# EasyEDA Pro project ProPrj_vTally32-Multi_2024-12-10.epro

# Schematic VISCA32CONV
Board Name: Board1; Create Date: 2024-11-26; Page Name: P1; Project Name: vTally32-Multi; Schematic Name: Schematic1; Update Date: 2024-12-03; Company: EasyEDA.com; Drawn: EasyEDA; Page Size: A4; Part Number: JLCPCB-002; Reviewed: EasyEDA; Version: V0.1
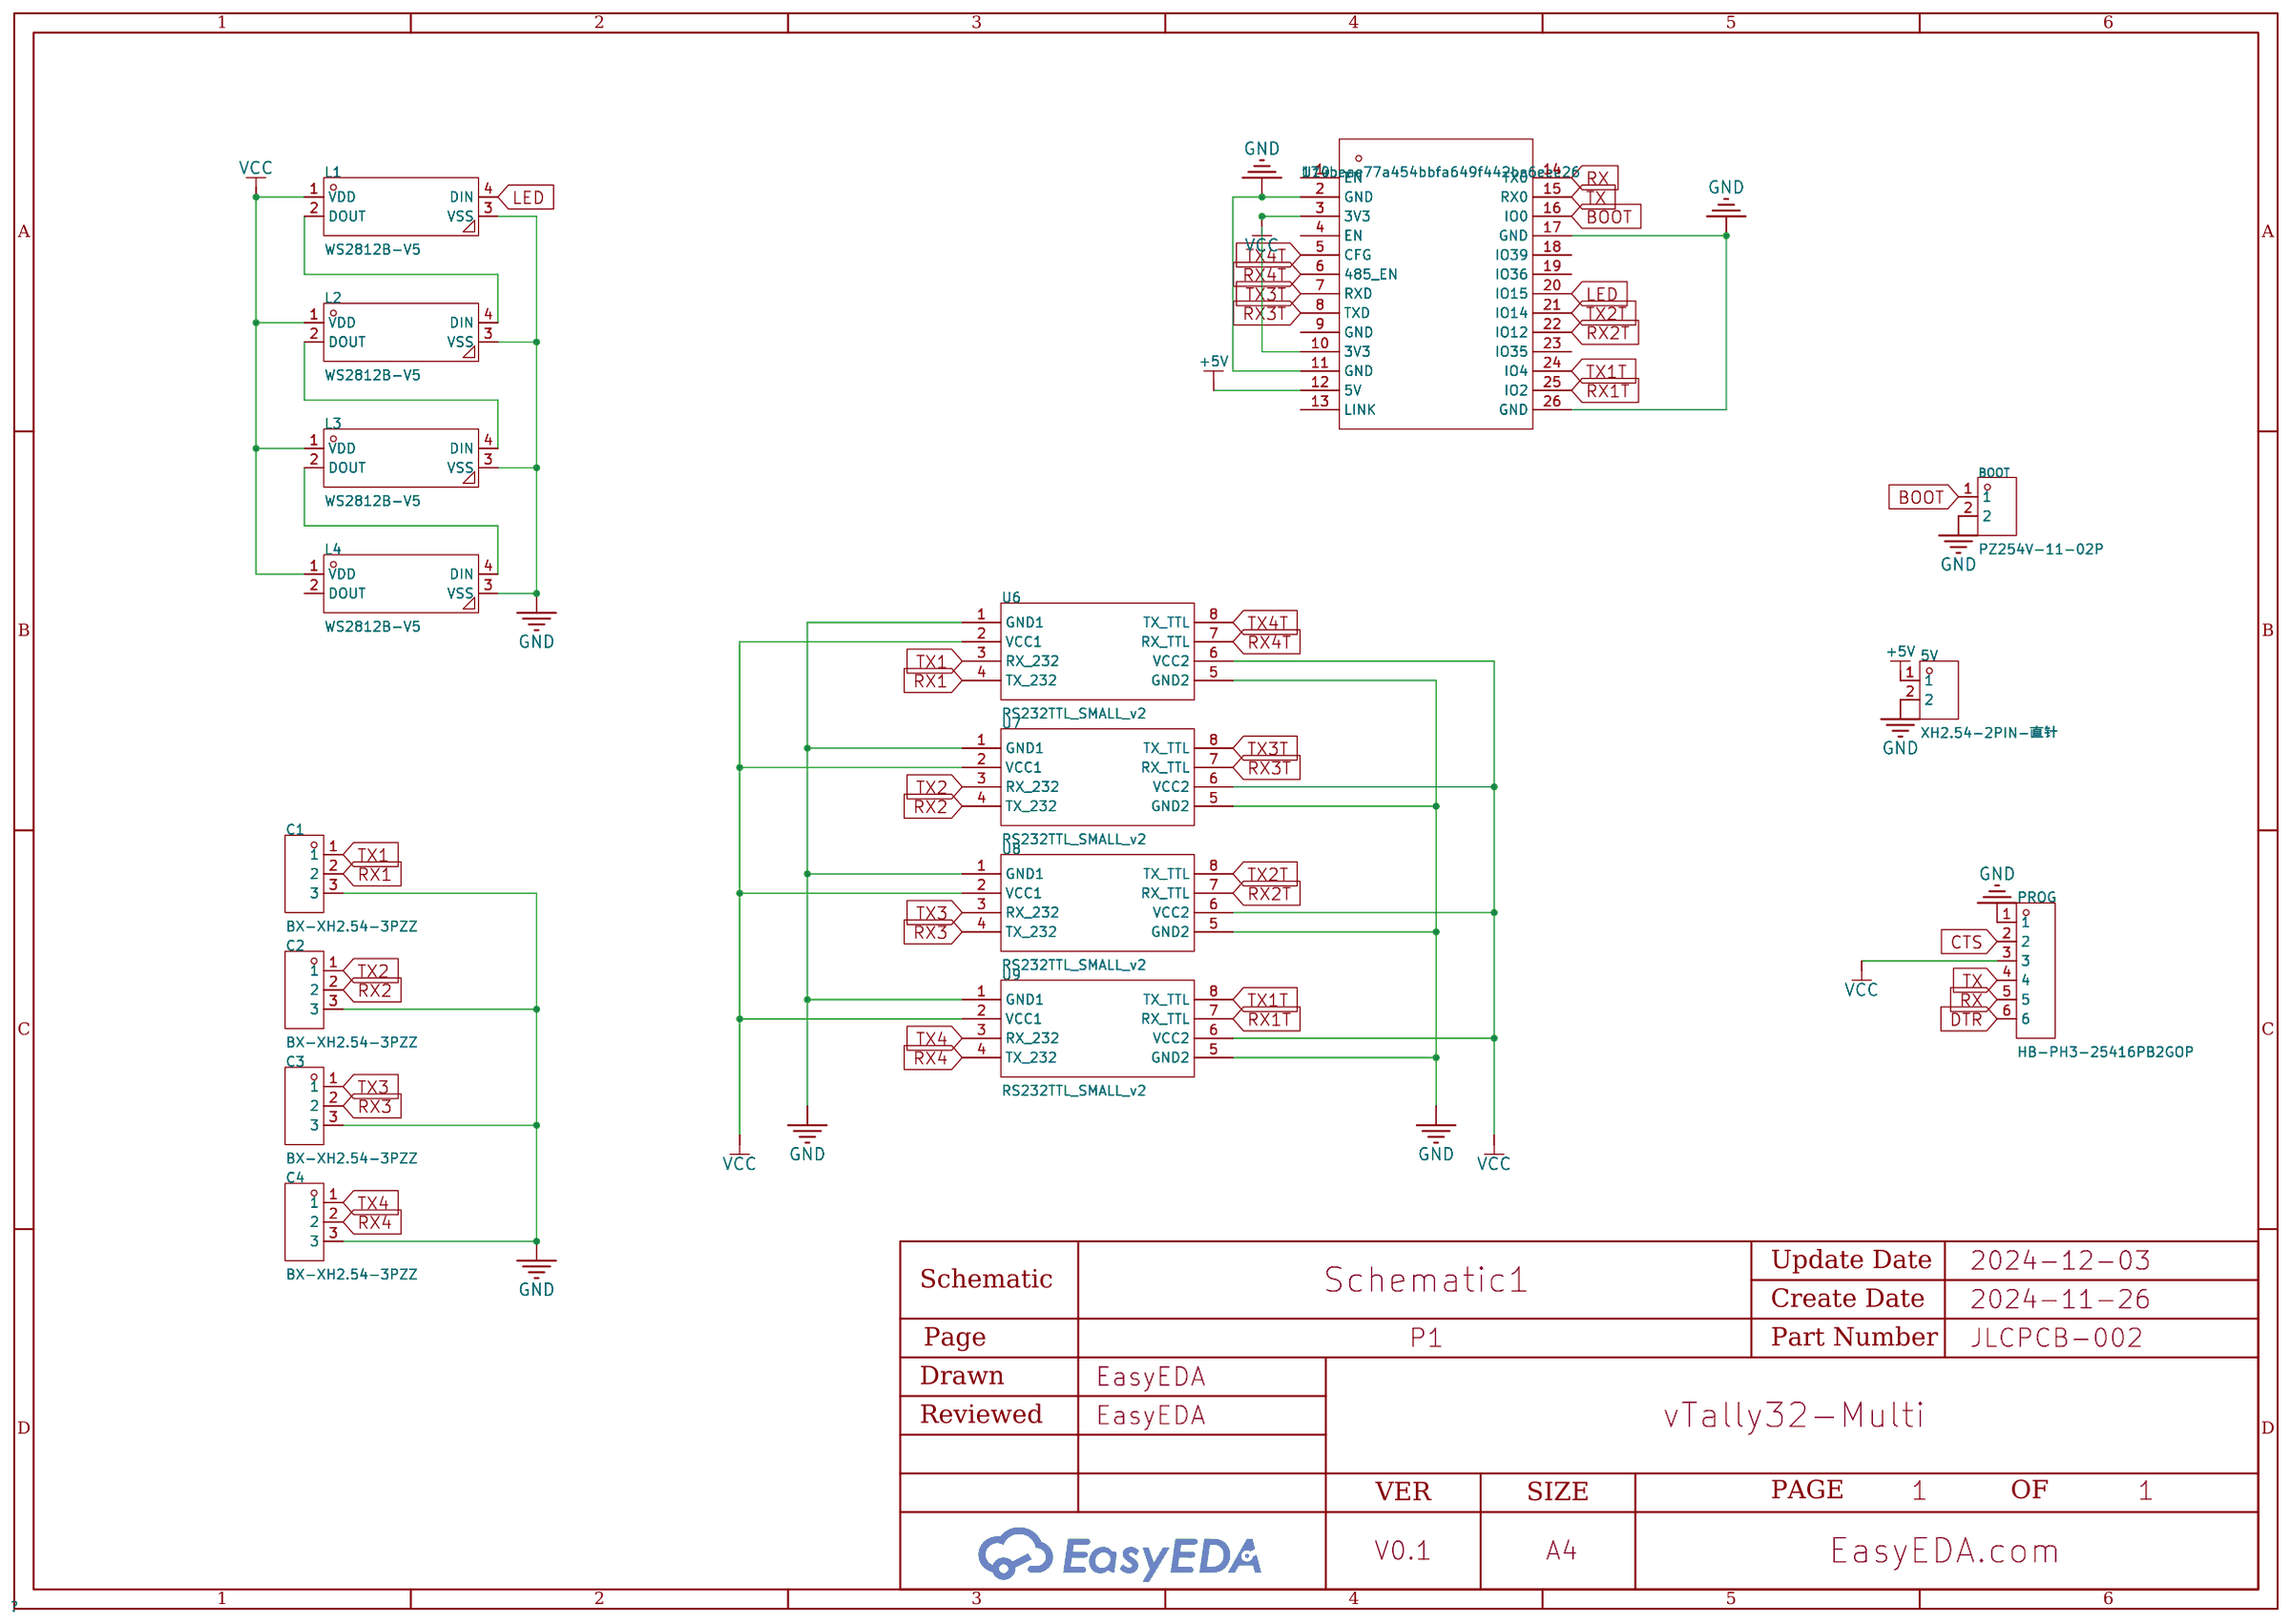
[diagram p0: schematic sheet]

## Parts
5V  XH2.54-2PIN-直针  [CONN-TH_XH2.54-2P]
BOOT  PZ254V-11-02P  [HDR-TH_2P-P2.54-V-M]
C1  BX-XH2.54-3PZZ  [CONN-TH_3P-P2.50_BX-XH2.54-3PZZ]
C2  BX-XH2.54-3PZZ  [CONN-TH_3P-P2.50_BX-XH2.54-3PZZ]
C3  BX-XH2.54-3PZZ  [CONN-TH_3P-P2.50_BX-XH2.54-3PZZ]
C4  BX-XH2.54-3PZZ  [CONN-TH_3P-P2.50_BX-XH2.54-3PZZ]
L1  WS2812B-V5  [LED-SMD_4P-L5.0-W5.0-LS5.4-TL-1]
L2  WS2812B-V5  [LED-SMD_4P-L5.0-W5.0-LS5.4-TL-1]
L3  WS2812B-V5  [LED-SMD_4P-L5.0-W5.0-LS5.4-TL-1]
L4  WS2812B-V5  [LED-SMD_4P-L5.0-W5.0-LS5.4-TL-1]
PROG  HB-PH3-25416PB2GOP  [HDR-TH_6P-P2.54-V-M]
U6  RS232TTL_SMALL_v2  [RS232TTL_SMALL]
U7  RS232TTL_SMALL_v2  [RS232TTL_SMALL]
U8  RS232TTL_SMALL_v2  [RS232TTL_SMALL]
U9  RS232TTL_SMALL_v2  [RS232TTL_SMALL]
U10  174beae77a454bbfa649f442be6eee26  [WT32-ETH01]

## Library data of the parts
5V = XH2.54-2PIN-直针: Supplier Part: C9900011425; Supplier Footprint: XH2.54-2PIN; JLCPCB Part Class: Extended Part; Supplier: LCSC
BOOT = PZ254V-11-02P: Pin Structure:1x2P Pitch:2.54mm Row Spacing:- Circluar Pins/Square Pins:Square Pins Mounting Type:Straight Number of Rows:Plugin Number of Pins:2P Current Rating (Max):- Voltage Rating (Max):- Length of Mating Pin:6mm Insulation Height:2.5mm Length of End; LCSC Part Name: 间距:2.54mm 1x2P 直插 方针; Supplier Part: C492401; Manufacturer: XFCN(兴飞); Supplier Footprint: 插件,P=2.54mm; JLCPCB Part Class: Extended Part; Datasheet: https://atta.szlcsc.com/upload/public/pdf/source/20200309/C492401_A812433581A9B211A7FFA413ADDFF0E5.pdf; Supplier: LCSC; Pin Structure: 1x2P; Pitch: 2.54mm; Circluar Pins/Square Pins: Square Pins; Mounting Type: Straight; Number of Rows: Plugin; Number of Pins: 2P; Length of Mating Pin: 6mm; Insulation Height: 2.5mm; Length of End Connection Pin: 3mm; Operating Temperature Range: -40℃~+105℃; Color: Black
C1-C4 = BX-XH2.54-3PZZ: Pins Structure:1x3P Pitch:2.54mm Mounting Style:Direct Insert Reference Series:XH Number of Pins:3P Number of Rows:1 Number of PINs Per Row:3 Row Spacing:- Current Rating (Max):3A Contact Material:Brass Contact Plating:Tin Operating Temperature Range:-25℃; Supplier Part: C18077834; Manufacturer: Bossie(博锡); Supplier Footprint: 插件,P=2.54mm; JLCPCB Part Class: Extended Part; Datasheet: https://atta.szlcsc.com/upload/public/pdf/source/20231017/BF89167887E1F965B2791D14EC788A09.pdf; Supplier: LCSC; Pins Structure: 1x3P; Pitch: 2.54mm; Mounting Style: Direct Insert; Reference Series: XH; Number of Pins: 3P; Number of Rows: 1; Number of PINs Per Row: 3; Current Rating (Max): 3A; Contact Material: Brass; Contact Plating: Tin; Operating Temperature Range: -25℃~+85℃
L1-L4 = WS2812B-V5_C2846931: Supplier Part: C2846931; Manufacturer: worldsemi; Supplier Footprint: SMD5050; JLCPCB Part Class: Extended Part; Datasheet: https://atta.szlcsc.com/upload/public/pdf/source/20211224/E1D51490BF3990BC3747CA833459C67A.pdf; Supplier: LCSC
PROG = HB-PH3-25416PB2GOP: Pin Structure:1x6P Pitch:2.54mm Row Spacing:2.54mm Circluar Pins/Square Pins:Square Pins Mounting Type:Straight Number of Rows:Plugin Number of Pins:6P Current Rating (Max):3A Voltage Rating (Max):250V Length of Mating Pin:6mm Insulation Height:2.54mm Len; LCSC Part Name: 间距:2.54mm 1x6P 直插 方针; Supplier Part: C6332199; Manufacturer: HANBO(汉博); Supplier Footprint: 插件,P=2.54mm; JLCPCB Part Class: Extended Part; Datasheet: https://atta.szlcsc.com/upload/public/pdf/source/20230803/F72D259687963761DF1B552F3BB84A31.pdf; Supplier: LCSC; Pin Structure: 1x6P; Pitch: 2.54mm; Row Spacing: 2.54mm; Circluar Pins/Square Pins: Square Pins; Mounting Type: Straight; Number of Rows: Plugin; Number of Pins: 6P; Current Rating (Max): 3A; Voltage Rating (Max): 250V; Length of Mating Pin: 6mm; Insulation Height: 2.54mm; Length of End Connection Pin: 3mm; Contact Plating: Gold; Operating Temperature Range: -40℃~+105℃; Soldering Temperature(Max): 260℃; Color: Black
U6-U9 = RS232TTL_SMALL_v2: Supplier: BANGGOOD
U10 = WT32-ETH01: Wireless-tag WT32-ETH01

## Nets
+5V: 5V.1 U10.12(5V)
GND: 5V.2 BOOT.2 C1.3 C2.3 C3.3 C4.3 L1.3(VSS) L2.3(VSS) L3.3(VSS) L4.3(VSS) PROG.1 U6.1(GND1) U6.5(GND2) U7.1(GND1) U7.5(GND2) U8.1(GND1) U8.5(GND2) U9.1(GND1) U9.5(GND2) U10.2(GND) U10.11(GND) U10.17(GND) U10.26(GND)
VCC: L1.1(VDD) L2.1(VDD) L3.1(VDD) L4.1(VDD) PROG.3 U6.2(VCC1) U6.6(VCC2) U7.2(VCC1) U7.6(VCC2) U8.2(VCC1) U8.6(VCC2) U9.2(VCC1) U9.6(VCC2) U10.3(3V3) U10.10(3V3)
BOOT: BOOT.1 U10.16(IO0)
CTS: PROG.2
DTR: PROG.6
LED: L1.4(DIN) U10.20(IO15)
RX: PROG.5 U10.14(TX0)
RX1: C1.2 U6.4(TX 232)
RX1T: U9.7(RX TTL) U10.25(IO2)
RX2: C2.2 U7.4(TX 232)
RX2T: U8.7(RX TTL) U10.22(IO12)
RX3: C3.2 U8.4(TX 232)
RX3T: U7.7(RX TTL) U10.8(TXD)
RX4: C4.2 U9.4(TX 232)
RX4T: U6.7(RX TTL) U10.6(485_EN)
TX: PROG.4 U10.15(RX0)
TX1: C1.1 U6.3(RX 232)
TX1T: U9.8(TX TTL) U10.24(IO4)
TX2: C2.1 U7.3(RX 232)
TX2T: U8.8(TX TTL) U10.21(IO14)
TX3: C3.1 U8.3(RX 232)
TX3T: U7.8(TX TTL) U10.7(RXD)
TX4: C4.1 U9.3(RX 232)
TX4T: U6.8(TX TTL) U10.5(CFG)
$1N1073: L1.2(DOUT) L2.4(DIN)
$1N1074: L2.2(DOUT) L3.4(DIN)
$1N1075: L3.2(DOUT) L4.4(DIN)

Not connected (* = marked no-connect by the designer): L4 2(DOUT); U10 1(EN) 4(EN) 9(GND) 13(LINK) 18(IO39) 19(IO36) 23(IO35)

# Board VISCA32CONV
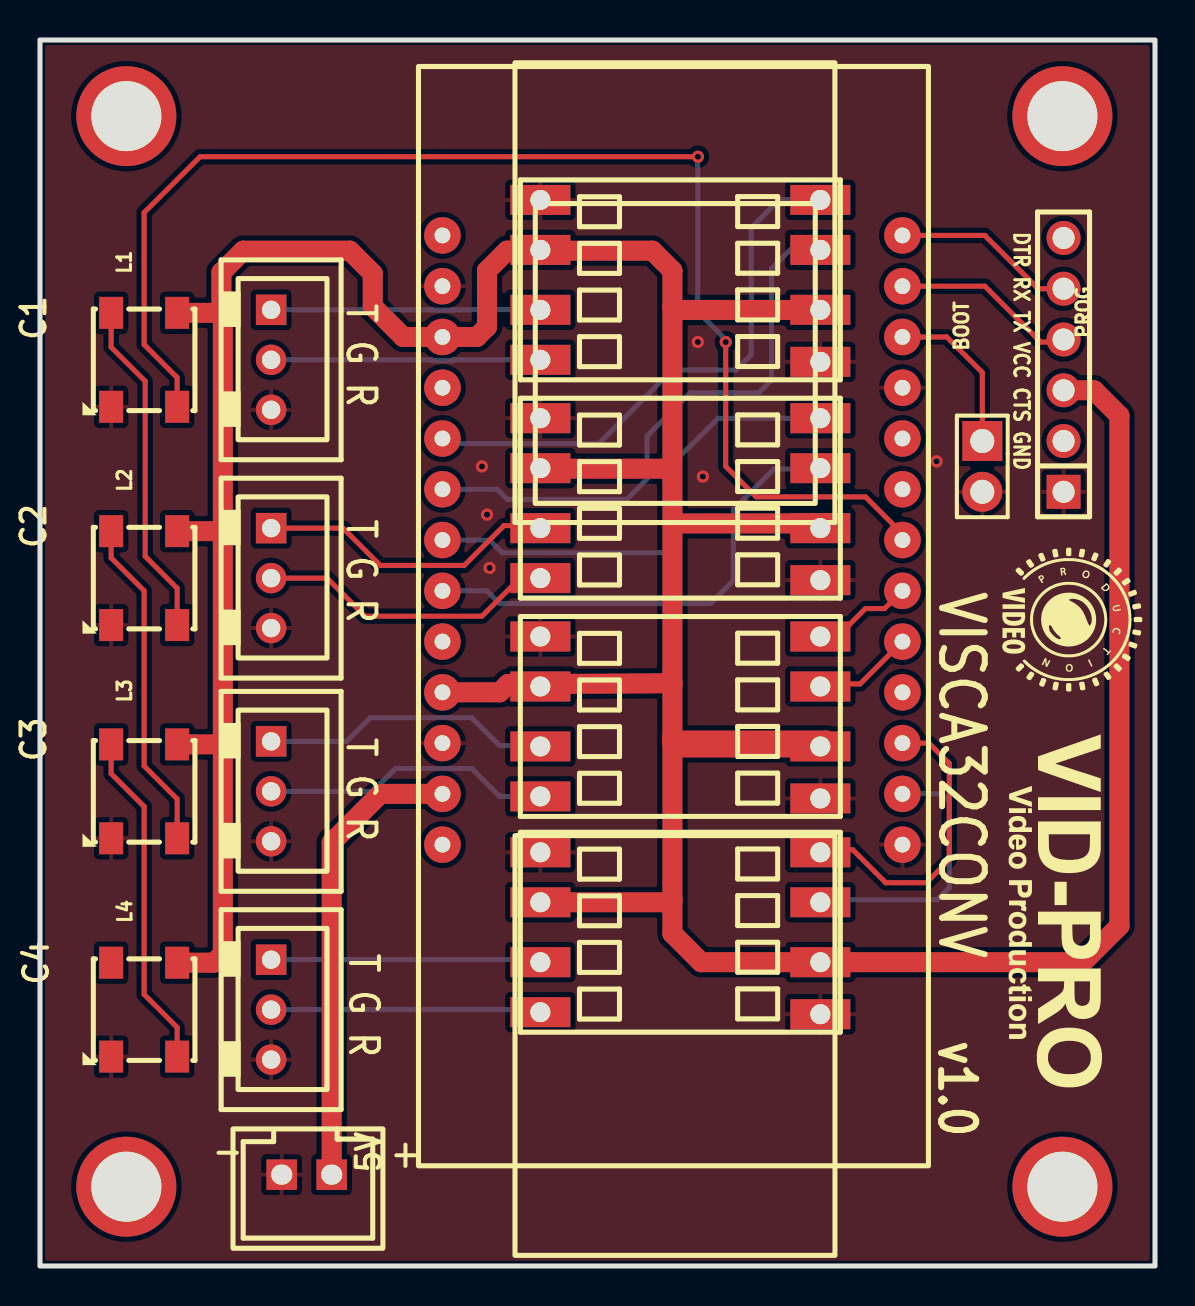
[diagram p1: board, top side]
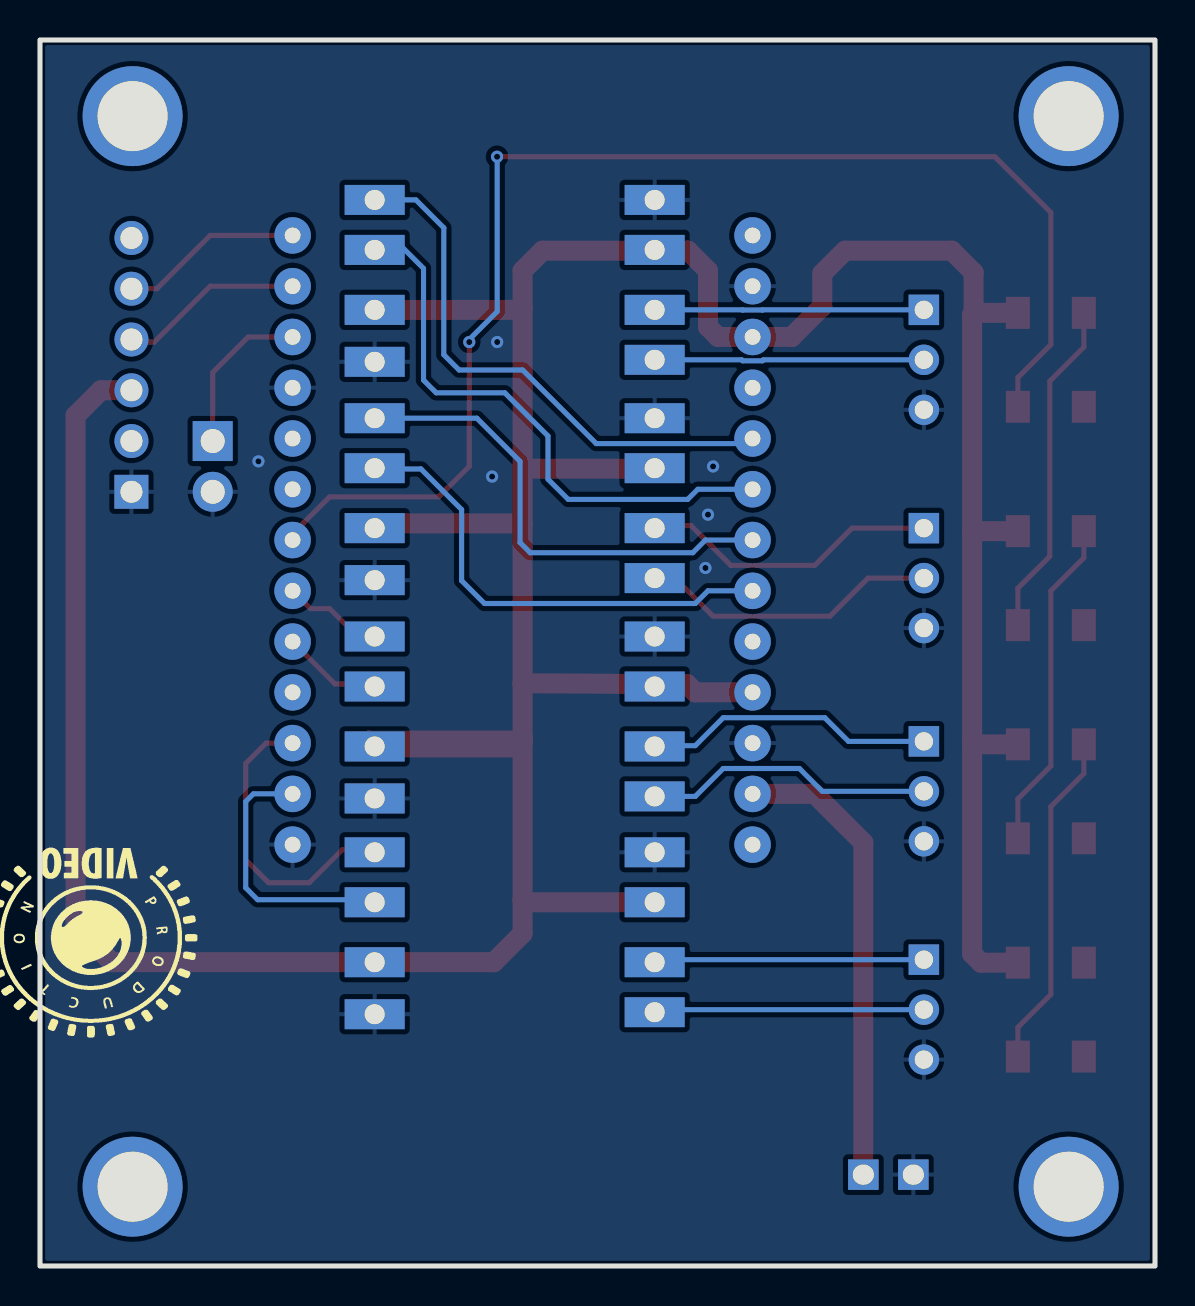
[diagram p2: board, bottom side, seen from below]

Outline 55.75 x 61.34 mm; copper layers: Top Layer, Bottom Layer. Coordinates in mm from the lower left corner of the outline.
Outline path: rectangle 0,61.34 55.75,0
Stack: Top Layer 0.035mm / Dielectric1 1.51mm FR4 er 4.5 / Bottom Layer 0.035mm

## Design rules (mm)
template: JLCPCB Capability(Two Layers Board)
spacing copperThickness1oz (default): track to track 0.102, other pairs 0.152 to 0.3
spacing copperThickness2oz: track to track 0.203, other pairs 0.152 to 0.3
track width copperThickness1oz (default): min 0.127, default 0.254, max 2.54
track width copperThickness2oz: min 0.203, default 0.254, max 2.54
differential pair differentialPair (default): width min 0.127, default 0.254, max 2.54; gap min 0.152, default 0.152
via viaSize (default): diameter min 0.5, default 0.61, max 10; hole min 0.3, default 0.305, max 6.3

## Placement (name value [footprint] x y rotation side)
5V  XH2.54-2PIN-直针  [CONN-TH_XH2.54-2P]  13.33 4.57 180 top
BOOT  PZ254V-11-02P  [HDR-TH_2P-P2.54-V-M]  47.12 40 270 top
C1  BX-XH2.54-3PZZ  [CONN-TH_3P-P2.50_BX-XH2.54-3PZZ]  11.56 45.34 270 top
C2  BX-XH2.54-3PZZ  [CONN-TH_3P-P2.50_BX-XH2.54-3PZZ]  11.56 34.42 270 top
C3  BX-XH2.54-3PZZ  [CONN-TH_3P-P2.50_BX-XH2.54-3PZZ]  11.56 23.75 270 top
C4  BX-XH2.54-3PZZ  [CONN-TH_3P-P2.50_BX-XH2.54-3PZZ]  11.56 12.83 270 top
L1  WS2812B-V5  [LED-SMD_4P-L5.0-W5.0-LS5.4-TL-1]  5.21 45.34 270 top
L2  WS2812B-V5  [LED-SMD_4P-L5.0-W5.0-LS5.4-TL-1]  5.21 34.42 270 top
L3  WS2812B-V5  [LED-SMD_4P-L5.0-W5.0-LS5.4-TL-1]  5.21 23.75 270 top
L4  WS2812B-V5  [LED-SMD_4P-L5.0-W5.0-LS5.4-TL-1]  5.21 12.83 270 top
NOREF  -  [Pad_e1110]  51.12 3.97 0 top
NOREF#2  -  [Pad_e1111]  4.32 3.97 0 top
NOREF#3  -  [Pad_e1035]  4.32 57.53 0 top
NOREF#4  -  [Pad_e1037]  51.12 57.53 0 top
PROG  HB-PH3-25416PB2GOP  [HDR-TH_6P-P2.54-V-M]  51.18 45.08 90 top
U6  RS232TTL_SMALL_v2  [RS232TTL_SMALL]  25.02 45.34 0 top
U7  RS232TTL_SMALL_v2  [RS232TTL_SMALL]  25.02 34.42 0 top
U8  RS232TTL_SMALL_v2  [RS232TTL_SMALL]  25.02 23.49 0 top
U9  RS232TTL_SMALL_v2  [RS232TTL_SMALL]  25.02 12.7 0 top
U10  174beae77a454bbfa649f442be6eee26  [WT32-ETH01]  71.12 16.26 0 top

## Footprints (pads in the part's own frame, mm; a bottom-side part is the same pattern mirrored in y, then rotated)
CONN-TH_3P-P2.50_BX-XH2.54-3PZZ
  rect 1.524x1.524 hole 0.914: 1(-2.5,0)
  round 1.524 hole 0.914: 2(0,0) 3(2.5,0)
CONN-TH_XH2.54-2P
  rect 1.524x1.524 hole 1.05x1: 1(-1.25,0) 2(1.25,0)
HDR-TH_2P-P2.54-V-M
  rect 2x2 hole 1.2: 1(-1.27,0)
  round 2 hole 1.2: 2(1.27,0)
HDR-TH_6P-P2.54-V-M
  rect 1.7x1.7 hole 1.1: 1(-6.35,0)
  round 1.7 hole 1.1: 2(-3.81,0) 3(-1.27,0) 4(1.27,0) 5(3.81,0) 6(6.35,0)
LED-SMD_4P-L5.0-W5.0-LS5.4-TL-1
  rect 1.6x1.2 smd: 1(-2.35,1.65) 2(-2.35,-1.65) 3(2.35,-1.65) 4(2.35,1.65)
Pad_e1035
  round 5 hole 3.5: 1(0,0)
Pad_e1037
  round 5 hole 3.5: 1(0,0)
Pad_e1110
  round 5 hole 3.5: 1(0,0)
Pad_e1111
  round 5 hole 3.5: 1(0,0)
RS232TTL_SMALL
  rect 3x1.5 hole 1: 1(0,8) 2(0,5.5) 3(0,2.5) 4(0,0) 5(14,-0.102) 6(14,2.5) 7(14,5.5) 8(14,8)
WT32-ETH01
  round 1.827 hole 0.787: 1(-50.997,35.306) 2(-50.997,32.766) 3(-50.997,30.226) 4(-50.997,27.686) 5(-50.997,25.146) 6(-50.997,22.606) 7(-50.997,20.066) 8(-50.997,17.526) 9(-50.997,14.986) 10(-50.997,12.446) 11(-50.997,9.906) 12(-50.997,7.366) 13(-50.997,4.826) 14(-27.997,35.306) 15(-27.997,32.766) 16(-27.997,30.226) 17(-27.997,27.686) 18(-27.997,25.146) 19(-27.997,22.606) 20(-27.997,20.066) 21(-27.997,17.526) 22(-27.997,14.986) 23(-27.997,12.446) 24(-27.997,9.906) 25(-27.997,7.366) 26(-27.997,4.826)

## Nets
As in the schematic.

Pads without a net: L4 2; NOREF 1; NOREF#2 1; NOREF#3 1; NOREF#4 1; U10 1 4 9 13 18 19 23

## Via types
v1: diameter 0.61, hole 0.305, Top Layer to Bottom Layer, 8 vias

## Routing (per net, layer and track width the routed paths; a pad name or vN(x,y) marks a point on that pad's centre or on a via; arc(x,y) is an arc through that point)
+5V: length 23.2
  Top Layer w1: 5V.1 14.58,21.19 17.02,23.62 U10.12
GND:
  vias: v1(22.1,40) v1(22.35,37.59) v1(22.48,34.92) v1(32.89,46.23) v1(33.15,39.5) v1(44.83,40.26)
VCC: length 215.4
  Top Layer w1: 31.62,37.16 39.54,37.16 39.65,37.04 ; 31.62,37.16 31.62,47.97 ; 31.62,37.16 31.62,29.16 ; 31.62,26.25 31.62,26.2 31.67,26.2 ; 31.62,26.25 31.67,26.2 ; 31.62,26.25 31.62,26.29 ; 31.62,18.33 31.5,18.2 U9.2 ; 31.62,18.33 31.62,16.64 33.06,15.2 U9.6 52.16,15.2 53.98,17.02 53.98,42.54 52.7,43.81 PROG.3 ; 31.62,18.33 31.62,26.14 31.67,26.2 ; 9.07,47.69 9.07,49.71 10.16,50.8 15.49,50.8 16.64,49.66 16.64,48.01 18.16,46.48 U10.3 21.84,46.48 22.35,46.99 22.35,49.8 23.35,50.8 30.62,50.8 31.62,49.8 31.62,47.97 ; 9.07,47.69 9.14,47.61 9.14,36.76 ; 9.07,47.69 L1.1 ; 31.67,26.2 31.85,26.02 ; 39.38,25.99 39.58,26.2 39.22,26.2 ; 31.62,47.97 31.75,47.83 39.01,47.83 U6.6 ; 9.14,26.15 9.09,26.1 L3.1 ; 9.14,26.15 9.14,15.62 8.7,15.18 L4.1 ; 9.14,26.15 9.14,36.76 ; 31.62,29.16 25.65,29.12 23.41,29.12 22.99,28.7 U10.10 ; 31.62,29.16 31.62,26.29 ; 25.65,40.04 25.81,39.89 31.59,39.89 ; 31.62,26.29 39.31,26.29 39.22,26.2 ; 39.22,26.2 U8.6 38.97,25.95 ; 38.97,25.95 31.93,25.95 31.85,26.02 ; 38.97,25.95 38.84,25.82 ; 9.14,36.76 9.14,36.77 L2.1 ; 31.85,26.02 31.67,25.84
BOOT: length 8.2
  Top Layer w0.254: BOOT.1 47.12,44.7 45.34,46.48 U10.16
LED: length 65.9
  Top Layer w0.254: 43.12,36.32 43.12,36.63 41.27,38.48 35.81,38.48 34.29,40.01 v1(34.29,46.23) ; L1.4 6.86,44.45 5.21,46.1 5.21,52.7 8,55.5 v1(32.9,55.5)
  Bottom Layer w0.254: v1(34.29,46.23) 34.29,46.36 32.89,47.75 32.89,55.49 v1(32.9,55.5)
RX: length 9.2
  Top Layer w0.254: U10.14 47.24,51.56 49.91,48.89 PROG.5
RX1: length 14.2
  Bottom Layer w0.254: C1.2 19.58,45.34 19.63,45.29 20.62,45.29 20.67,45.34 25.53,45.34 25.65,45.47
RX1T: length 12.9
  Bottom Layer w0.254: U10.25 45.08,23.62 45.47,23.24 45.47,18.92 44.87,18.33 39.65,18.33
RX2: length 15.7
  Top Layer w0.254: C2.2 14.35,34.42 16.26,32.51 22.1,32.51 24.13,34.54 25.65,34.54
RX2T: length 4.3
  Top Layer w0.254: 39.65,29.12 41,29.12 43.12,31.24
RX3: length 15.2
  Bottom Layer w0.254: 25.65,23.62 25.53,23.49 22.99,23.49 21.59,24.89 17.78,24.89 16.64,23.75 C3.2
RX3T: length 24.7
  Bottom Layer w0.254: 39.65,40.04 39.49,39.88 36.7,39.88 34.67,37.85 34.67,34.29 33.53,33.15 22.99,33.15 22.35,33.78 U10.8
RX4: length 14.1
  Bottom Layer w0.254: C4.2 25.65,12.83
RX4T: length 29.5
  Bottom Layer w0.254: U10.6 22.86,38.86 23.37,38.35 29.34,38.35 30.35,39.37 30.35,41.53 32.51,43.69 35.94,43.69 36.58,44.32 36.58,49.91 37.63,50.97 39.65,50.97
TX: length 9.3
  Top Layer w0.254: PROG.4 51.05,46.23 50.04,46.23 47.24,49.02 U10.15
TX1: length 14.2
  Bottom Layer w0.254: 25.65,47.97 25.53,47.84 20.63,47.84 20.62,47.83 19.63,47.83 19.62,47.84 C1.1
TX1T: length 14.6
  Top Layer w0.254: 39.65,20.83 40.64,20.83 42.29,19.18 44.32,19.18 45.47,20.32 45.47,25.15 44.45,26.16 43.12,26.16
TX2: length 15.7
  Top Layer w0.254: C2.1 15.15,36.92 17.02,35.05 21.21,35.05 23.2,37.04 25.65,37.04
TX2T: length 4.4
  Top Layer w0.254: U10.21 42.23,32.89 41.27,32.89 40,31.62 39.65,31.62
TX3: length 15.2
  Bottom Layer w0.254: 25.65,26.12 25.57,26.03 22.99,26.03 21.59,27.43 16.51,27.43 15.33,26.25 C3.1
TX3T: length 25
  Bottom Layer w0.254: 20.12,36.32 22.48,36.32 23.11,35.69 31.24,35.69 31.75,36.19 31.75,40.26 33.91,42.42 39.53,42.42 39.65,42.54
TX4: length 14.1
  Bottom Layer w0.254: C4.1 25.65,15.33
TX4T: length 28.5
  Bottom Layer w0.254: 39.65,53.47 39.53,53.34 36.96,53.34 35.56,51.94 35.56,45.59 34.8,44.83 31.62,44.83 27.94,41.15 20.38,41.15 U10.5
$1N1073: length 17
  Top Layer w0.254: L1.2 3.56,45.97 5.26,44.27 5.26,35.51 6.86,33.91 6.86,32.07
$1N1074: length 16.7
  Top Layer w0.254: L2.2 3.56,35.43 5.21,33.78 5.21,25.02 6.86,23.37 6.86,21.4
$1N1075: length 17
  Top Layer w0.254: 6.86,10.48 6.86,11.94 5.21,13.59 5.21,22.99 3.56,24.64 L3.2

## Copper pours and planes (outline as drawn; the poured copper is in the pictures)
GND on Top Layer: -1.27,63.5 58.93,63.5 58.93,-3.3 -1.27,-3.3
GND on Bottom Layer: -4.06,62.74 56.9,62.74 56.9,-1.02 -4.06,-1.02

## Text on the board
Top Silkscreen Layer: DTR RX TX VCC CTS GND | T G R | - | + | v1.0 | VISCA32CONV
